# Altium project 自研超级电容控制器_DEMO5.PrjPcb
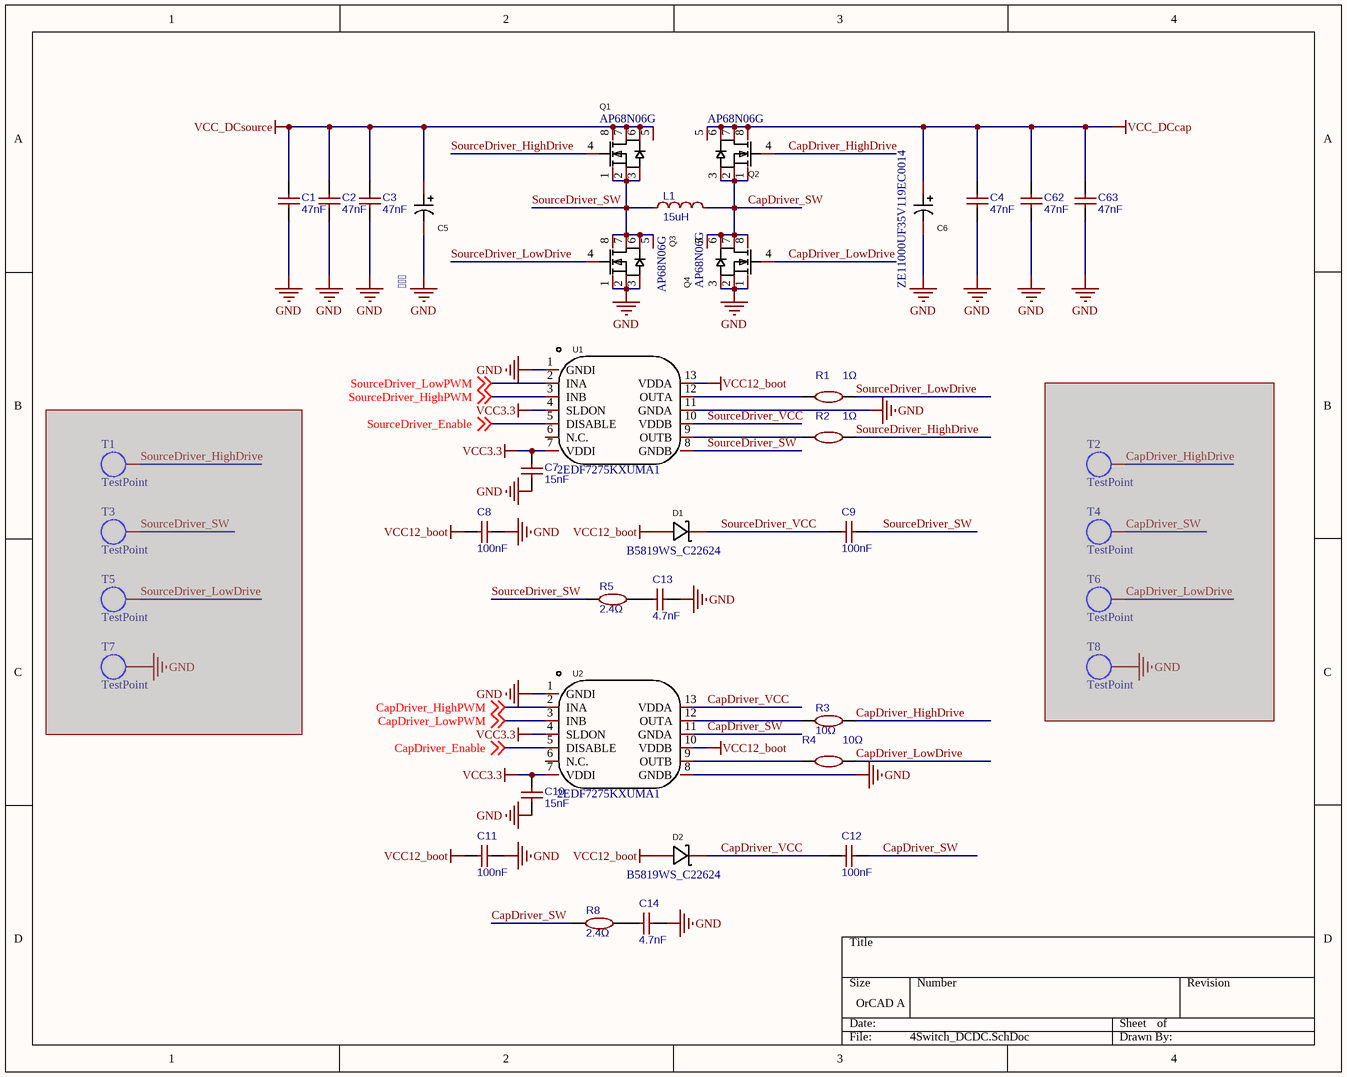
[diagram p0: 4Switch_DCDC.SchDoc]
4 sheets, 201 parts. Net scope: global (net labels, ports and power ports of the same name join across sheets).
Board file: PCB2.PcbDoc
Sheets:
  4Switch_DCDC.SchDoc
  PowerManagement.SchDoc
  Signal.SchDoc
  Controller.SchDoc

## Sheet 4Switch_DCDC.SchDoc
size OrCAD A; SheetNumber: 1; SheetTotal: 4

### Parts
C1  47nF  [C-RAD-0805]
C2  47nF  [C-RAD-0805]
C3  47nF  [C-RAD-0805]
C4  47nF  [C-RAD-0805]
C5    [CAP-TH_BD10.0-P5.00-D0.6-FD-A]
C6  ZE11000UF35V119EC0014  [CAP-TH_BD10.0-P5.00-D0.6-FD-A]
C7  15nF  [C-RAD-0603]
C8  100nF  [C-RAD-0603]
C9  100nF  [C-RAD-0603]
C10  15nF  [C-RAD-0603]
C11  100nF  [C-RAD-0603]
C12  100nF  [C-RAD-0603]
C13  4.7nF  [C-RAD-0805]
C14  4.7nF  [C-RAD-0805]
C62  47nF  [C-RAD-0805]
C63  47nF  [C-RAD-0805]
D1  B5819WS_C22624  [SOD-323_L1.8-W1.3-LS2.5-BI]
D2  B5819WS_C22624  [SOD-323_L1.8-W1.3-LS2.5-BI]
L1  15uH  [L-SMD-22]
Q1  AP68N06G  [VDFN8]
Q2  AP68N06G  [VDFN8]
Q3  AP68N06G  [VDFN8]
Q4  AP68N06G  [VDFN8]
R1  1Ω  [0603-1]
R2  1Ω  [0603-1]
R3  10Ω  [0603-1]
R4  10Ω  [0603-1]
R5  2.4Ω  [0805-1]
R8  2.4Ω  [0805-1]
T1  TestPoint  [TestPoint]  (masked out: inside a compile mask, not in the netlist)
T2  TestPoint  [TestPoint]  (masked out: inside a compile mask, not in the netlist)
T3  TestPoint  [TestPoint]  (masked out: inside a compile mask, not in the netlist)
T4  TestPoint  [TestPoint]  (masked out: inside a compile mask, not in the netlist)
T5  TestPoint  [TestPoint]  (masked out: inside a compile mask, not in the netlist)
T6  TestPoint  [TestPoint]  (masked out: inside a compile mask, not in the netlist)
T7  TestPoint  [TestPoint]  (masked out: inside a compile mask, not in the netlist)
T8  TestPoint  [TestPoint]  (masked out: inside a compile mask, not in the netlist)
U1  2EDF7275KXUMA1  [LGA-13]
U2  2EDF7275KXUMA1  [LGA-13]

### Nets
GND: C1.1 C2.1 C3.1 C4.1 C5.2 C6.2 C7.1 C8.2 C10.1 C11.2 C13.2 C14.2 C62.1 C63.1 Q3.1(S) Q3.2(S) Q3.3(S) Q4.1(S) Q4.2(S) Q4.3(S) U1.1(GNDI) U1.11(GNDA) U2.1(GNDI) U2.8(GNDB)
VCC3.3: C7.2 C10.2 U1.4(SLDON) U1.7(VDDI) U2.4(SLDON) U2.7(VDDI)
VCC12_boot: C8.1 C11.1 D1.2(A) D2.2(A) U1.13(VDDA) U2.10(VDDB)
VCC_DCcap: C4.2 C6.1 C62.2 C63.2 Q2.5(D) Q2.6(D) Q2.7(D) Q2.8(D)
VCC_DCsource: C1.2 C2.2 C3.2 C5.1 Q1.5(D) Q1.6(D) Q1.7(D) Q1.8(D)
CapDriver_Enable: U2.5(DISABLE) ; off-sheet CapDriver_Enable
CapDriver_HighDrive: Q2.4(G) R3.2
CapDriver_HighPWM: U2.2(INA) ; off-sheet CapDriver_HighPWM
CapDriver_LowDrive: Q4.4(G) R4.2
CapDriver_LowPWM: U2.3(INB) ; off-sheet CapDriver_LowPWM
CapDriver_SW: C12.2 L1.2 Q2.1(S) Q2.2(S) Q2.3(S) Q4.5(D) Q4.6(D) Q4.7(D) Q4.8(D) R8.1 U2.11(GNDA)
CapDriver_VCC: C12.1 D2.1(K) U2.13(VDDA)
SourceDriver_Enable: U1.5(DISABLE) ; off-sheet SourceDriver_Enable
SourceDriver_HighDrive: Q1.4(G) R2.2
SourceDriver_HighPWM: U1.3(INB) ; off-sheet SourceDriver_HighPWM
SourceDriver_LowDrive: Q3.4(G) R1.2
SourceDriver_LowPWM: U1.2(INA) ; off-sheet SourceDriver_LowPWM
SourceDriver_SW: C9.2 L1.1 Q1.1(S) Q1.2(S) Q1.3(S) Q3.5(D) Q3.6(D) Q3.7(D) Q3.8(D) R5.1 U1.8(GNDB)
SourceDriver_VCC: C9.1 D1.1(K) U1.10(VDDB)
NetC13_1: C13.1 R5.2
NetC14_1: C14.1 R8.2
NetR1_1: R1.1 U1.12(OUTA)
NetR2_1: R2.1 U1.9(OUTB)
NetR3_1: R3.1 U2.12(OUTA)
NetR4_1: R4.1 U2.9(OUTB)

Not connected (* = marked no-connect by the designer): U1 6(N.C.); U2 6(N.C.)

### Library data of the parts
C1-C4 C62 C63 = 47nF: CL21B473KBCNNNC; BOM_Manufacturer: Guangdong Fenghua Advanced Tech; nameAlias: Capacitance; Contributor: LCSC; BOM_Supplier: LCSC; BOM_Supplier Part: C157687; BOM_Manufacturer Part: CL21B473KBCNNNC; BOM_JLCPCB Part Class: Extended Part; spicePre: C; spiceSymbolName: 0805CG330J500NT
C5 C6 = ZE11000UF35V119EC0014: Manufacturer: KNSCHA(科尼盛); Name: 1000uF; Add into BOM: yes; Value: 1000uF; Tolerance: ±20%; Rated Voltage: 35V; φD: 10mm; L: 17mm; Ripple Current: 6.2A@100kHz; Equivalent Series Resistance(ESR): 8mΩ@100kHz; Lifetime @ Temp: 2000hrs@105℃; Symbol: ZE11000UF35V119EC0014; Device: ZE11000UF35V119EC0014; LCSC Part Name: 1000uF ±20% 35V; Supplier Part: C2992586; Manufacturer Part: ZE11000UF35V119EC0014; Supplier Footprint: 径向引线,10x17mm; JLCPCB Part Class: Extended Part; Datasheet: https://atta.szlcsc.com/upload/public/pdf/source/20220418/57B24F92C08E224D784EAACECC03E503.pdf; Supplier: LCSC; Convert to PCB: yes; Lead Spacing: 5mm; Operating Temperature: -40℃~+105℃
C7 C10 = 15nF: BOM_Manufacturer: Guangdong Fenghua Advanced Tech; BOM_Manufacturer Part: 0805CG330J500NT; nameAlias: Capacitance; Contributor: LCSC; BOM_Supplier: LCSC; BOM_Supplier Part: C157687; BOM_JLCPCB Part Class: Extended Part; spicePre: C; spiceSymbolName: 0805CG330J500NT
C8 C9 C11 C12 = 100nF: BOM_Manufacturer: Guangdong Fenghua Advanced Tech; BOM_Manufacturer Part: 0805CG330J500NT; nameAlias: Capacitance; Contributor: LCSC; BOM_Supplier: LCSC; BOM_Supplier Part: C157687; BOM_JLCPCB Part Class: Extended Part; spicePre: C; spiceSymbolName: 0805CG330J500NT
C13 C14 = 4.7nF: BOM_Manufacturer: Guangdong Fenghua Advanced Tech; BOM_Manufacturer Part: 0805CG330J500NT; nameAlias: Capacitance; Contributor: LCSC; BOM_Supplier: LCSC; BOM_Supplier Part: C157687; BOM_JLCPCB Part Class: Extended Part; spicePre: C; spiceSymbolName: 0805CG330J500NT
D1 D2 = B5819WS_C22624: Manufacturer: CJ(江苏长电/长晶); Add into BOM: yes; Reverse Voltage (Vr): 40V; Average Rectified Current (Io): 1A; Forward Voltage (Vf@If): 600mV@1A; Name: B5819WS; Symbol: B5819WS_C22624; Device: B5819WS_C22624; LCSC Part Name: 40V 1A 600mV@1A; Supplier Part: C22624; Manufacturer Part: B5819WS; Supplier Footprint: SOD-323; JLCPCB Part Class: Extended Part; Datasheet: https://atta.szlcsc.com/upload/public/pdf/source/20170919/C22624_1505799673448977596.pdf; Supplier: LCSC; Convert to PCB: yes
L1 = 15uH_CY: BOM_Manufacturer: 3L COILS; BOM_Manufacturer Part: SNR8040K-470M; nameAlias: Inductance; Contributor: LCSC; BOM_Supplier: LCSC; BOM_Supplier Part: C326356; spicePre: L; spiceSymbolName: SNR8040K-470M
Q1-Q4 = AP68N06G: Manufacturer: AOS; Name: AO3400A; Device: AO3400A_C20917; Add into BOM: yes; Type: N沟道; Drain Source Voltage (Vdss): 30V; Continuous Drain Current (Id): 5.7A; Power Dissipation (Pd): 1.4W; Drain Source On Resistance (RDS(on)@Vgs,Id): 26.5mΩ@10V,5.7A; Gate Threshold Voltage (Vgs(th)@Id): 1.5V@250μA; Symbol: AO3400A; LCSC Part Name: N沟道 30V 5.7A; Supplier Part: C20917; Manufacturer Part: AO3400A; Supplier Footprint: SOT-23-3L; JLCPCB Part Class: Basic Part; Datasheet: https://atta.szlcsc.com/upload/public/pdf/source/20140107/1457706668533.pdf; Supplier: LCSC; Convert to PCB: yes
R1-R4 = 10Ω: BOM_Manufacturer: UniOhm; BOM_Manufacturer Part: 0603WAF1002T5E; nameAlias: Resistance; Resistance (Ohms): 10K; BOM_Supplier: LCSC; BOM_Supplier Part: C25804; BOM_JLCPCB Part Class: Basic Part; spicePre: R; spiceSymbolName: 0603WAF1002T5E
R5 R8 = 2.4Ω: BOM_Manufacturer: UniOhm; BOM_Manufacturer Part: 0603WAF1002T5E; nameAlias: Resistance; Resistance (Ohms): 10K; BOM_Supplier: LCSC; BOM_Supplier Part: C25804; BOM_JLCPCB Part Class: Basic Part; spicePre: R; spiceSymbolName: 0603WAF1002T5E
U1 U2 = 2EDF7275KXUMA1: Manufacturer: Infineon(英飞凌); Add into BOM: yes; Driven Configuration: 半桥; Number of Drivers: 2; loadtype: MOSFET; Supply Voltage: 3V~3.5V; Peak Output Current(sink): 4A; Peak Output Current(source): 8A; Rise Time: 6.5ns; Fall Time: 4.5ns; Name: 2EDF7275KXUMA1; Symbol: 2EDF7275KXUMA1; Device: 2EDF7275KXUMA1; LCSC Part Name: 半桥 MOSFET 灌:4A 拉:8A; Supplier Part: C2677063; Manufacturer Part: 2EDF7275KXUMA1; Supplier Footprint: TFLGA-13-1; JLCPCB Part Class: Extended Part; Datasheet: https://atta.szlcsc.com/upload/public/pdf/source/20210606/C69F41D9A598FEEE25D6E8D6BBA83E77.pdf; Supplier: LCSC; Convert to PCB: yes; Operating Temperature: -40℃~+150℃@(Tj)

## Sheet PowerManagement.SchDoc
size OrCAD A; SheetNumber: 2; SheetTotal: 4
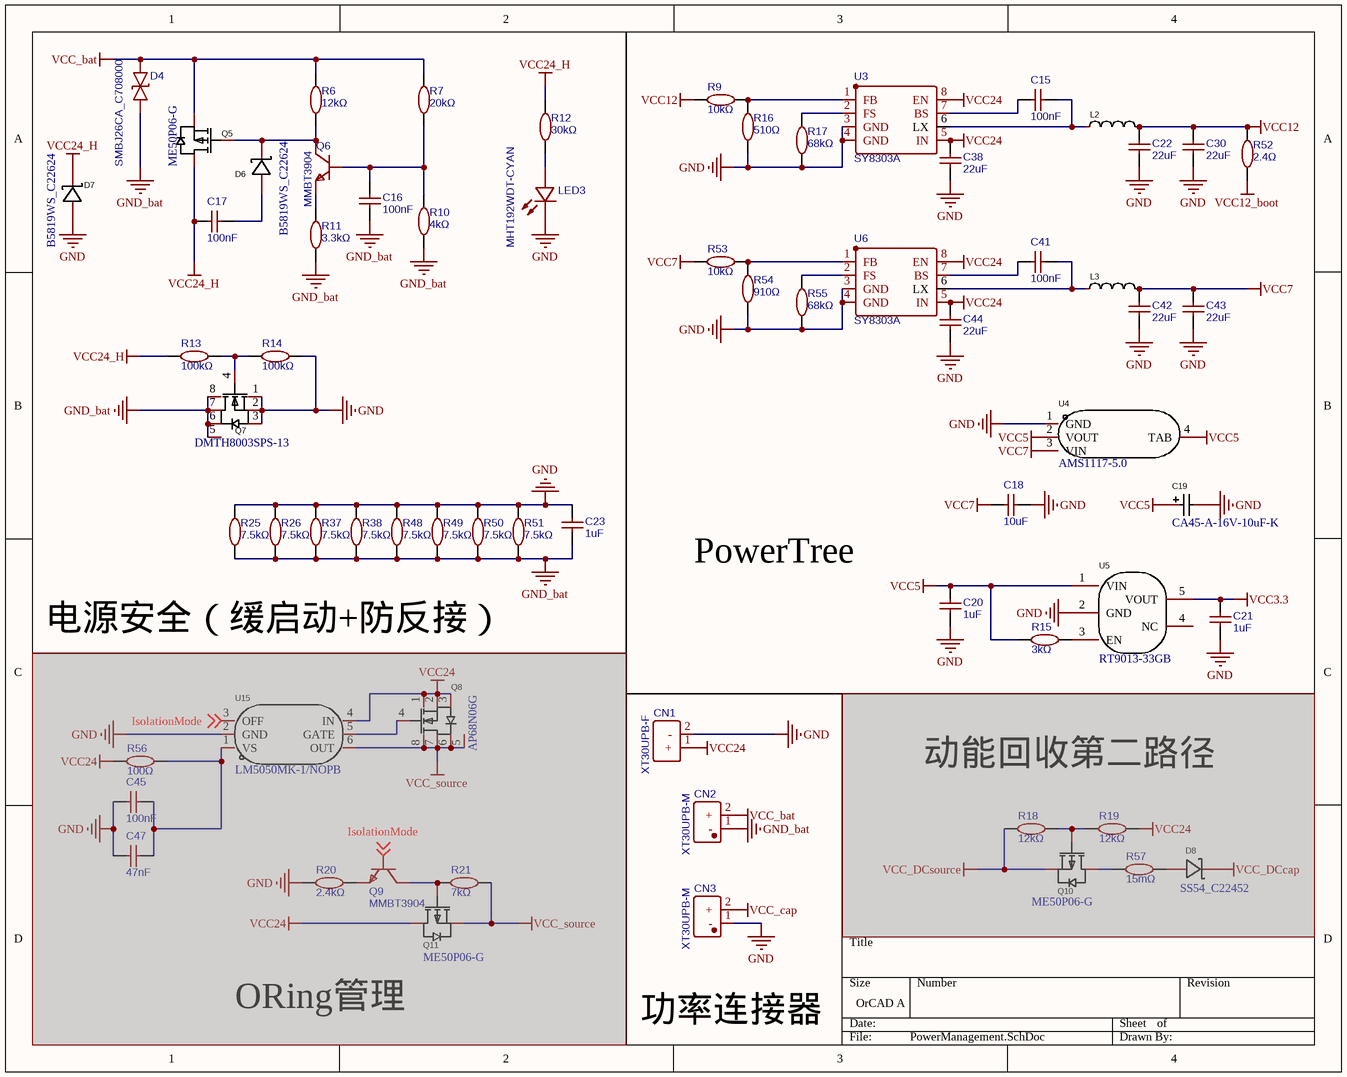
[diagram p1: PowerManagement.SchDoc]

### Parts
(Parts that share a designator on the sheet are numbered #1, #2 ... from top to bottom, then left to right.)
C15  100nF  [C-RAD-0603]
C16  100nF  [C-RAD-0603]
C17  100nF  [C-RAD-0603]
C18  10uF  [C-RAD-0805]
C19  CA45-A-16V-10uF-K  [CAP-3216]
C20  1uF  [C-RAD-0603]
C21  1uF  [C-RAD-0603]
C22  22uF  [C-RAD-0805]
C23  1uF  [C-RAD-0603]
C30  22uF  [C-RAD-0805]
C38  22uF  [C-RAD-0805]
C41  100nF  [C-RAD-0603]
C42  22uF  [C-RAD-0805]
C43  22uF  [C-RAD-0805]
C44  22uF  [C-RAD-0805]
C45#1  100nF  [C-RAD-0603]  (masked out: inside a compile mask, not in the netlist)
C47#1  47nF  [C-RAD-0805]  (masked out: inside a compile mask, not in the netlist)
CN1  XT30UPB-F  [CONN-TH_XT30UPB-F]
CN2  XT30UPB-M  [CONN-TH_XT30UPB-M]
CN3  XT30UPB-M  [CONN-TH_XT30UPB-M]
D4  SMBJ26CA_C708000  [SMB_L4.6-W3.6-LS5.3-BI]
D6  B5819WS_C22624  [SOD-323_L1.8-W1.3-LS2.5-BI]
D7  B5819WS_C22624  [SOD-323_L1.8-W1.3-LS2.5-BI]
D8  SS54_C22452  [SMA_L4.4-W2.8-LS5.4-R-RD]  (masked out: inside a compile mask, not in the netlist)
L2  MWSA0402S-100MT  [L-SMD-4.5]  (value not drawn)
L3  MWSA0402S-100MT  [L-SMD-4.5]  (value not drawn)
LED3  MHT192WDT-CYAN  [LED_0805]
Q5  ME50P06-G  [TO-252-2]
Q6  MMBT3904  [SOT-23]
Q7  DMTH8003SPS-13  [PowerDI5060-8]
Q8  AP68N06G  [VDFN8]  (masked out: inside a compile mask, not in the netlist)
Q9  MMBT3904  [SOT-23]  (masked out: inside a compile mask, not in the netlist)
Q10  ME50P06-G  [TO-252-2]  (masked out: inside a compile mask, not in the netlist)
Q11  ME50P06-G  [TO-252-2]  (masked out: inside a compile mask, not in the netlist)
R6  12kΩ  [0603-1]
R7  20kΩ  [0603-1]
R9  10kΩ  [0603-1]
R10  4kΩ  [0603-1]
R11  3.3kΩ  [0603-1]
R12  30kΩ  [0603-1]
R13  100kΩ  [0603-1]
R14  100kΩ  [0603-1]
R15  3kΩ  [0603-1]
R16  510Ω  [0603-1]
R17  68kΩ  [0603-1]
R18  12kΩ  [0603-1]  (masked out: inside a compile mask, not in the netlist)
R19  12kΩ  [0603-1]  (masked out: inside a compile mask, not in the netlist)
R20  2.4kΩ  [0603-1]  (masked out: inside a compile mask, not in the netlist)
R21  7kΩ  [0603-1]  (masked out: inside a compile mask, not in the netlist)
R25  7.5kΩ  [0805-1]
R26  7.5kΩ  [0805-1]
R37  7.5kΩ  [0805-1]
R38  7.5kΩ  [0805-1]
R48  7.5kΩ  [0805-1]
R49  7.5kΩ  [0805-1]
R50  7.5kΩ  [0805-1]
R51  7.5kΩ  [0805-1]
R52  2.4Ω  [0603-1]
R53  10kΩ  [0603-1]
R54  910Ω  [0603-1]
R55  68kΩ  [0603-1]
R56  100Ω  [0603-1]  (masked out: inside a compile mask, not in the netlist)
R57  15mΩ  [2512]  (masked out: inside a compile mask, not in the netlist)
U3  SY8303A  [TSOT23-8]
U4  AMS1117-5.0  [SOT-223]
U5  RT9013-33GB  [SOT-23-5_L3.0-W1.7-P0.95-LS2.8-BL]
U6  SY8303A  [TSOT23-8]
U15  LM5050MK-1/NOPB  [TSOT23-6]  (masked out: inside a compile mask, not in the netlist)

### Nets
GND: C18.2 C19.2 C20.2 C21.2 C22.1 C23.2 C30.1 C38.1 C42.1 C43.1 C44.1 CN1.2(-) CN3.1(-) D7.2(A) LED3.2(K) Q7.1(S) Q7.2(S) Q7.3(S) R14.1 R16.1 R17.1 R25.2 R26.2 R37.2 R38.2 R48.2 R49.2 R50.2 R51.2 R54.1 R55.1 U3.3(GND) U3.4(GND) U4.1(GND) U5.2(GND) U6.3(GND) U6.4(GND)
GND_bat: C16.1 C23.1 CN2.1(-) D4.1 Q7.5(D) Q7.6(D) Q7.7(D) Q7.8(D) R10.1 R11.1 R25.1 R26.1 R37.1 R38.1 R48.1 R49.1 R50.1 R51.1
VCC3.3: C21.1 U5.5(VOUT)
VCC5: C19.1 C20.1 R15.1 U4.2(VOUT) U4.4(TAB) U5.1(VIN)
VCC7: C18.1 C42.2 C43.2 L3.2 R53.1 U4.3(VIN)
VCC12: C22.2 C30.2 L2.2 R9.1 R52.1
VCC12_boot: R52.2
VCC24: C38.2 C44.2 CN1.1(+) U3.5(IN) U3.8(EN) U6.5(IN) U6.8(EN)
VCC24_H: C17.2 D7.1(K) Q5.2(D) R12.2 R13.2
VCC_bat: CN2.2(+) D4.2 Q5.3(S) R6.2 R7.2
VCC_cap: CN3.2(+)
NetC15_1: C15.1 L2.1 U3.6(LX)
NetC15_2: C15.2 U3.7(BS)
NetC16_2: C16.2 Q6.1(B) R7.1 R10.2
NetC17_1: C17.1 D6.2(A)
NetC41_1: C41.1 L3.1 U6.6(LX)
NetC41_2: C41.2 U6.7(BS)
NetD6_1: D6.1(K) Q5.1(G) Q6.3(C) R6.1
NetLED3_1: LED3.1(A) R12.1
NetQ6_2: Q6.2(E) R11.2
NetQ7_4: Q7.4(G) R13.1 R14.2
NetR9_2: R9.2 R16.2 U3.1(FB)
NetR15_2: R15.2 U5.3(EN)
NetR17_2: R17.2 U3.2(FS)
NetR53_2: R53.2 R54.2 U6.1(FB)
NetR55_2: R55.2 U6.2(FS)

Not connected (* = marked no-connect by the designer): U5 4(NC)

### Notes on the sheet
- PowerTree
- 电源安全（缓启动+防反接）
- 动能回收第二路径
- ORing管理
- 功率连接器

### Library data of the parts
C15-C17 C41 C45#1 = 100nF: as C8 on sheet 4Switch_DCDC; BOM_Supplier: LCSC; BOM_Supplier Part: C157687; BOM_JLCPCB Part Class: Extended Part; spicePre: C; spiceSymbolName: 0805CG330J500NT
C18 = 10uF: BOM_Manufacturer: Guangdong Fenghua Advanced Tech; BOM_Manufacturer Part: 0805CG330J500NT; nameAlias: Capacitance; Contributor: LCSC; BOM_Supplier: LCSC; BOM_Supplier Part: C157687; BOM_JLCPCB Part Class: Extended Part; spicePre: C; spiceSymbolName: 0805CG330J500NT
C19 = CA45-A-16V-10uF-K: Manufacturer: CEC(振华新云); Name: 10uF; Add into BOM: yes; Value: 10uF; Tolerance: ±10%; Rated Voltage: 16V; Equivalent Series Resistance(ESR): 10Ω@100kHz; Symbol: CA45-A-16V-10UF-K; Device: CA45-A-16V-10uF-K; LCSC Part Name: 10uF ±10% 16V; Supplier Part: C128254; Manufacturer Part: CA45-A-16V-10uF-K; Supplier Footprint: CASE-A-3216; JLCPCB Part Class: Extended Part; Datasheet: https://atta.szlcsc.com/upload/public/pdf/source/20170914/C128254_1505359752472967905.pdf; Supplier: LCSC; Convert to PCB: yes; Operating Temperature: -55℃~+125℃
C20 C21 C23 = 1uF: BOM_Manufacturer: Guangdong Fenghua Advanced Tech; BOM_Manufacturer Part: 0805CG330J500NT; nameAlias: Capacitance; Contributor: LCSC; BOM_Supplier: LCSC; BOM_Supplier Part: C157687; BOM_JLCPCB Part Class: Extended Part; spicePre: C; spiceSymbolName: 0805CG330J500NT
C22 C30 C38 C42-C44 = 22uF: BOM_Manufacturer: Guangdong Fenghua Advanced Tech; BOM_Manufacturer Part: 0805CG330J500NT; nameAlias: Capacitance; Contributor: LCSC; BOM_Supplier: LCSC; BOM_Supplier Part: C157687; BOM_JLCPCB Part Class: Extended Part; spicePre: C; spiceSymbolName: 0805CG330J500NT
C47#1 = 47nF: as C1 on sheet 4Switch_DCDC; BOM_Supplier: LCSC; BOM_Supplier Part: C157687; BOM_Manufacturer Part: CL21B473KBCNNNC; BOM_JLCPCB Part Class: Extended Part; spicePre: C; spiceSymbolName: 0805CG330J500NT
CN1 = XT30UPB-F: BOM_Manufacturer: Changzhou Amass Elec; nameAlias: Value; Contributor: LCSC; BOM_Supplier: LCSC; BOM_Supplier Part: C108769; BOM_Manufacturer Part: XT30UPB-F; BOM_JLCPCB Part Class: Extended Part; spicePre: C; spiceSymbolName: XT30UPB-F
CN2 CN3 = XT30UPB-M: BOM_Manufacturer: Changzhou Amass Elec; Contributor: LCSC; BOM_Supplier: LCSC; BOM_Supplier Part: C428721; BOM_Manufacturer Part: XT30UPB-M; BOM_JLCPCB Part Class: Extended Part; spicePre: C; spiceSymbolName: XT30UPB-M
D4 = SMBJ26CA_C708000: BOM_Manufacturer: FTR; Contributor: LCSC; BOM_Supplier: LCSC; BOM_Supplier Part: C708000; BOM_Manufacturer Part: SMBJ26CA; BOM_JLCPCB Part Class: Extended Part; spicePre: D; spiceSymbolName: SMBJ26CA_C708000
D6 D7 = B5819WS_C22624: as D1 on sheet 4Switch_DCDC; Name: B5819WS; Symbol: B5819WS_C22624; Device: B5819WS_C22624; LCSC Part Name: 40V 1A 600mV@1A; Supplier Part: C22624; Manufacturer Part: B5819WS; Supplier Footprint: SOD-323; JLCPCB Part Class: Extended Part; Datasheet: https://atta.szlcsc.com/upload/public/pdf/source/20170919/C22624_1505799673448977596.pdf; Supplier: LCSC; Convert to PCB: yes
D8 = SS54_C22452: Manufacturer: MDD; Name: SS54; Add into BOM: yes; Reverse Voltage (Vr): 40V; Average Rectified Current (Io): 5A; Forward Voltage (Vf@If): 550mV@5A; Symbol: SS54_C22452; Device: SS54_C22452; LCSC Part Name: 40V 5A 550mV@5A; Supplier Part: C22452; Manufacturer Part: SS54; Supplier Footprint: SMA(DO-214AC); JLCPCB Part Class: Basic Part; Datasheet: https://atta.szlcsc.com/upload/public/pdf/source/20190306/C22452_DC5E4F74C3B638F6D8E4C7650D5BF30E.pdf; Supplier: LCSC; Convert to PCB: yes
L2 L3 = MWSA0402S-100MT: Manufacturer: Sunlord(顺络); Name: 10uH; Add into BOM: yes; Value: 10uH; Tolerance: ±20%; Rated Current: 1.6A; Saturation Current (Isat): 2A; DC Resistance (DCR): 282mΩ; Symbol: MWSA0402S-100MT; Device: MWSA0402S-100MT; LCSC Part Name: 10uH ±20% 2A; Supplier Part: C408339; Manufacturer Part: MWSA0402S-100MT; Supplier Footprint: SMD; JLCPCB Part Class: Extended Part; Datasheet: https://atta.szlcsc.com/upload/public/pdf/source/20190729/C408339_3BC98729F1BEEFAE5AEBBEB66576AB79.pdf; Supplier: LCSC; Convert to PCB: yes; Type: -; Ratings: -
LED3 = MHT192WDT-CYAN: BOM_Manufacturer: MEIHUA; Contributor: LCSC; BOM_Supplier: LCSC; BOM_Supplier Part: C496821; BOM_Manufacturer Part: MHT192WDT-CYAN; BOM_JLCPCB Part Class: Extended Part; spicePre: L; spiceSymbolName: MHT192WDT-CYAN
Q5 Q10 Q11 = ME50P06-G: Manufacturer: MATSUKI(松木); Add into BOM: yes; Type: P沟道; Drain Source Voltage (Vdss): 60V; Continuous Drain Current (Id): 61A; Power Dissipation (Pd): 114W; Drain Source On Resistance (RDS(on)@Vgs,Id): 17mΩ@10V,17A; Gate Threshold Voltage (Vgs(th)@Id): 3V@250μA; Name: ME50P06-G; Symbol: ME50P06; Device: ME50P06-G; LCSC Part Name: P沟道 60V 61A; Supplier Part: C165230; Manufacturer Part: ME50P06-G; Supplier Footprint: TO-252-2(DPAK); JLCPCB Part Class: Extended Part; Datasheet: https://atta.szlcsc.com/upload/public/pdf/source/20180316/EC2C67353FCE0BEDF2188A18E5230379.pdf; Supplier: LCSC; Convert to PCB: yes
Q6 Q9 = MMBT3904: BOM_Manufacturer: High Diode; BOM_Manufacturer Part: S8050; Contributor: LCSC; BOM_Supplier: LCSC; BOM_Supplier Part: C466625; BOM_JLCPCB Part Class: Extended Part; spicePre: Q; spiceSymbolName: S8050_C466625
Q7 = DMTH8003SPS-13: Manufacturer: AOS; Name: AO3400A; Device: AO3400A_C20917; Add into BOM: yes; Type: N沟道; Drain Source Voltage (Vdss): 30V; Continuous Drain Current (Id): 5.7A; Power Dissipation (Pd): 1.4W; Drain Source On Resistance (RDS(on)@Vgs,Id): 26.5mΩ@10V,5.7A; Gate Threshold Voltage (Vgs(th)@Id): 1.5V@250μA; Symbol: AO3400A; LCSC Part Name: N沟道 30V 5.7A; Supplier Part: C20917; Manufacturer Part: AO3400A; Supplier Footprint: SOT-23-3L; JLCPCB Part Class: Basic Part; Datasheet: https://atta.szlcsc.com/upload/public/pdf/source/20140107/1457706668533.pdf; Supplier: LCSC; Convert to PCB: yes
Q8 = AP68N06G: as Q1 on sheet 4Switch_DCDC; Symbol: AO3400A; LCSC Part Name: N沟道 30V 5.7A; Supplier Part: C20917; Manufacturer Part: AO3400A; Supplier Footprint: SOT-23-3L; JLCPCB Part Class: Basic Part; Datasheet: https://atta.szlcsc.com/upload/public/pdf/source/20140107/1457706668533.pdf; Supplier: LCSC; Convert to PCB: yes
R6 R18 R19 = 12kΩ: BOM_Manufacturer: UniOhm; BOM_Manufacturer Part: 0603WAF1002T5E; nameAlias: Resistance; Resistance (Ohms): 10K; BOM_Supplier: LCSC; BOM_Supplier Part: C25804; BOM_JLCPCB Part Class: Basic Part; spicePre: R; spiceSymbolName: 0603WAF1002T5E
R7 = 20kΩ: BOM_Manufacturer: UniOhm; BOM_Manufacturer Part: 0603WAF1002T5E; nameAlias: Resistance; Resistance (Ohms): 10K; BOM_Supplier: LCSC; BOM_Supplier Part: C25804; BOM_JLCPCB Part Class: Basic Part; spicePre: R; spiceSymbolName: 0603WAF1002T5E
R9 R53 = 10kΩ: BOM_Manufacturer: UniOhm; BOM_Manufacturer Part: 0603WAF1002T5E; nameAlias: Resistance; Resistance (Ohms): 10K; BOM_Supplier: LCSC; BOM_Supplier Part: C25804; BOM_JLCPCB Part Class: Basic Part; spicePre: R; spiceSymbolName: 0603WAF1002T5E
R10 = 4kΩ: BOM_Manufacturer: UniOhm; BOM_Manufacturer Part: 0603WAF1002T5E; nameAlias: Resistance; Resistance (Ohms): 10K; BOM_Supplier: LCSC; BOM_Supplier Part: C25804; BOM_JLCPCB Part Class: Basic Part; spicePre: R; spiceSymbolName: 0603WAF1002T5E
R11 = 3.3kΩ: BOM_Manufacturer: UniOhm; BOM_Manufacturer Part: 0603WAF1002T5E; nameAlias: Resistance; Resistance (Ohms): 10K; BOM_Supplier: LCSC; BOM_Supplier Part: C25804; BOM_JLCPCB Part Class: Basic Part; spicePre: R; spiceSymbolName: 0603WAF1002T5E
R12 = 30kΩ: BOM_Manufacturer: UniOhm; BOM_Manufacturer Part: 0603WAF1002T5E; nameAlias: Resistance; Resistance (Ohms): 10K; BOM_Supplier: LCSC; BOM_Supplier Part: C25804; BOM_JLCPCB Part Class: Basic Part; spicePre: R; spiceSymbolName: 0603WAF1002T5E
R13 R14 = 100kΩ: BOM_Manufacturer: UniOhm; BOM_Manufacturer Part: 0603WAF1002T5E; nameAlias: Resistance; Resistance (Ohms): 10K; BOM_Supplier: LCSC; BOM_Supplier Part: C25804; BOM_JLCPCB Part Class: Basic Part; spicePre: R; spiceSymbolName: 0603WAF1002T5E
R15 = 3kΩ: BOM_Manufacturer: UniOhm; BOM_Manufacturer Part: 0603WAF1002T5E; nameAlias: Resistance; Resistance (Ohms): 10K; BOM_Supplier: LCSC; BOM_Supplier Part: C25804; BOM_JLCPCB Part Class: Basic Part; spicePre: R; spiceSymbolName: 0603WAF1002T5E
R16 = 510Ω: BOM_Manufacturer: UniOhm; BOM_Manufacturer Part: 0603WAF1002T5E; nameAlias: Resistance; Resistance (Ohms): 10K; BOM_Supplier: LCSC; BOM_Supplier Part: C25804; BOM_JLCPCB Part Class: Basic Part; spicePre: R; spiceSymbolName: 0603WAF1002T5E
R17 R55 = 68kΩ: BOM_Manufacturer: UniOhm; BOM_Manufacturer Part: 0603WAF1002T5E; nameAlias: Resistance; Resistance (Ohms): 10K; BOM_Supplier: LCSC; BOM_Supplier Part: C25804; BOM_JLCPCB Part Class: Basic Part; spicePre: R; spiceSymbolName: 0603WAF1002T5E
R20 = 2.4kΩ: BOM_Manufacturer: UniOhm; BOM_Manufacturer Part: 0603WAF1002T5E; nameAlias: Resistance; Resistance (Ohms): 10K; BOM_Supplier: LCSC; BOM_Supplier Part: C25804; BOM_JLCPCB Part Class: Basic Part; spicePre: R; spiceSymbolName: 0603WAF1002T5E
R21 = 7kΩ: BOM_Manufacturer: UniOhm; BOM_Manufacturer Part: 0603WAF1002T5E; nameAlias: Resistance; Resistance (Ohms): 10K; BOM_Supplier: LCSC; BOM_Supplier Part: C25804; BOM_JLCPCB Part Class: Basic Part; spicePre: R; spiceSymbolName: 0603WAF1002T5E
R25 R26 R37 R38 R48-R51 = 7.5kΩ: BOM_Manufacturer: UniOhm; BOM_Manufacturer Part: 0603WAF1002T5E; nameAlias: Resistance; Resistance (Ohms): 10K; BOM_Supplier: LCSC; BOM_Supplier Part: C25804; BOM_JLCPCB Part Class: Basic Part; spicePre: R; spiceSymbolName: 0603WAF1002T5E
R52 = 2.4Ω: as R5 on sheet 4Switch_DCDC; BOM_Supplier: LCSC; BOM_Supplier Part: C25804; BOM_JLCPCB Part Class: Basic Part; spicePre: R; spiceSymbolName: 0603WAF1002T5E
R54 = 910Ω: BOM_Manufacturer: UniOhm; BOM_Manufacturer Part: 0603WAF1002T5E; nameAlias: Resistance; Resistance (Ohms): 10K; BOM_Supplier: LCSC; BOM_Supplier Part: C25804; BOM_JLCPCB Part Class: Basic Part; spicePre: R; spiceSymbolName: 0603WAF1002T5E
R56 = 100Ω: BOM_Manufacturer: UniOhm; BOM_Manufacturer Part: 0603WAF1002T5E; nameAlias: Resistance; Resistance (Ohms): 10K; BOM_Supplier: LCSC; BOM_Supplier Part: C25804; BOM_JLCPCB Part Class: Basic Part; spicePre: R; spiceSymbolName: 0603WAF1002T5E
R57 = 15mΩ: BOM_Manufacturer: UniOhm; BOM_Manufacturer Part: 0603WAF1002T5E; nameAlias: Resistance; Resistance (Ohms): 10K; BOM_Supplier: LCSC; BOM_Supplier Part: C25804; BOM_JLCPCB Part Class: Basic Part; spicePre: R; spiceSymbolName: 0603WAF1002T5E
U3 U6 = SY8303A: BOM_Manufacturer: Texas Instruments; BOM_Manufacturer Part: TPS5430DDAG4; Contributor: LCSC; BOM_Supplier: LCSC; BOM_Supplier Part: C201628; BOM_JLCPCB Part Class: Extended Part; spicePre: U; spiceSymbolName: TPS5430DDAG4
U4 = AMS1117-5.0: Manufacturer: UMW(广东友台半导体); Name: AMS1117-3.3; Symbol: AMS1117-3.3_C347222; Add into BOM: yes; Output Type: 固定; Output Polarity: 正; Number of Outputs: 1; Maximum Input Voltage: 18V; Output Voltage: 3.3V; Dropout Voltage: 1.3V@(1A); Output Current: 1A; Power Supply Rejection Ratio (PSRR): 60dB@(120Hz); Device: AMS1117-3.3_C347222; LCSC Part Name: 正 Vin=18V Vout=3.3V 1A 60dB@(120Hz); Supplier Part: C347222; Manufacturer Part: AMS1117-3.3; Supplier Footprint: SOT-223-4; JLCPCB Part Class: Extended Part; Datasheet: https://atta.szlcsc.com/upload/public/pdf/source/20211011/50CC665C22E3A66C08379A4A74BDA25C.pdf; Supplier: LCSC; Convert to PCB: yes
U5 = RT9013-33GB: Manufacturer: RICHTEK(台湾立锜); Add into BOM: yes; Output Type: 固定; Output Polarity: 正; Number of Outputs: 1; Maximum Input Voltage: 5.5V; Output Voltage: 3.3V; Dropout Voltage: 400mV@(500mA); Output Current: 500mA; Power Supply Rejection Ratio (PRSS): 50dB@(10kHz); Name: RT9013-33GB; Symbol: RT9013-33GB; Device: RT9013-33GB; LCSC Part Name: Vin=5.5V Vout=3.3V 500mA 50dB@(10kHz); Supplier Part: C47773; Manufacturer Part: RT9013-33GB; Supplier Footprint: SOT-23-5; JLCPCB Part Class: Extended Part; Datasheet: https://atta.szlcsc.com/upload/public/pdf/source/20150504/1457707282459.pdf; Supplier: LCSC; Convert to PCB: yes; Quiescent Current (Ground Current): -; Noise: -; Feature: -
U15 = LM5050MK-1/NOPB: Manufacturer: TI(德州仪器); Add into BOM: yes; Name: LM5050MK-1/NOPB; Symbol: LM5050MK-1/NOPB; Device: LM5050MK-1/NOPB; LCSC Part Name: LM5050MK-1/NOPB; Supplier Part: C129323; Manufacturer Part: LM5050MK-1/NOPB; Supplier Footprint: TSOT-23-6; JLCPCB Part Class: Extended Part; Datasheet: https://atta.szlcsc.com/upload/public/pdf/source/20170914/C129323_1505359957620968163.pdf; Supplier: LCSC; Convert to PCB: yes

## Sheet Signal.SchDoc
size OrCAD A; SheetNumber: 3; SheetTotal: 4
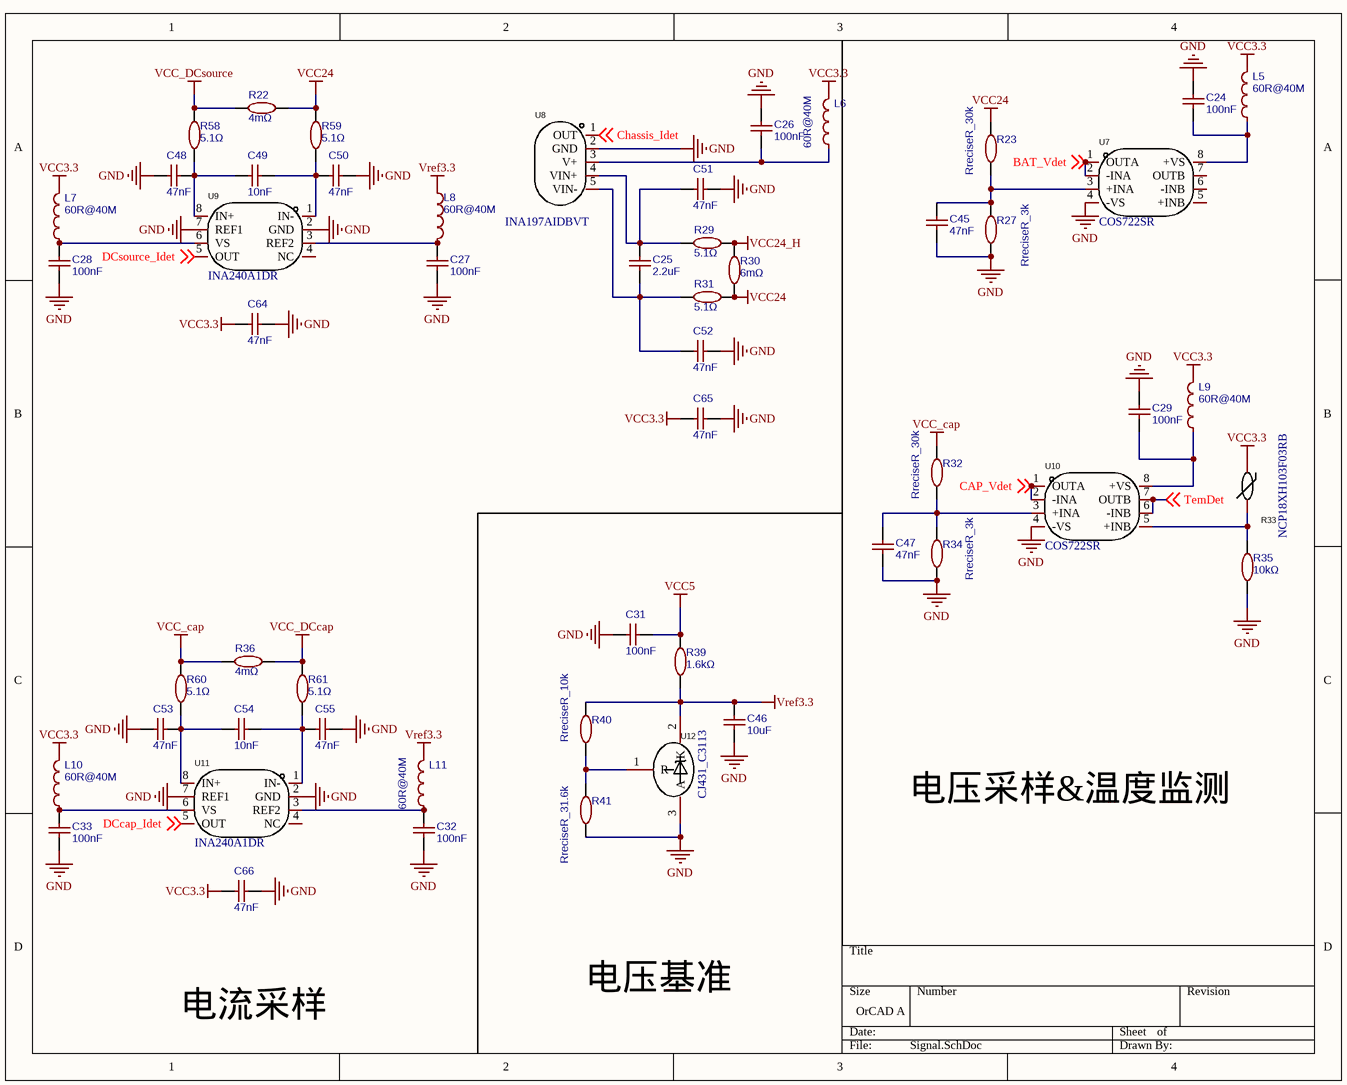
[diagram p2: Signal.SchDoc]

### Parts
(Parts that share a designator on the sheet are numbered #1, #2 ... from top to bottom, then left to right.)
C24  100nF  [C-RAD-0603]
C25  2.2uF  [C-RAD-0603]
C26  100nF  [C-RAD-0603]
C27  100nF  [C-RAD-0603]
C28  100nF  [C-RAD-0603]
C29  100nF  [C-RAD-0603]
C31  100nF  [C-RAD-0603]
C32  100nF  [C-RAD-0603]
C33  100nF  [C-RAD-0603]
C45#2  47nF  [C-RAD-0805]
C46  10uF  [C-RAD-0805]
C47#2  47nF  [C-RAD-0805]
C48  47nF  [C-RAD-0805]
C49  10nF  [C-RAD-0603]
C50  47nF  [C-RAD-0805]
C51  47nF  [C-RAD-0805]
C52  47nF  [C-RAD-0805]
C53  47nF  [C-RAD-0805]
C54  10nF  [C-RAD-0603]
C55  47nF  [C-RAD-0805]
C64  47nF  [C-RAD-0805]
C65  47nF  [C-RAD-0805]
C66  47nF  [C-RAD-0805]
L5  60R@40M  [0603-1]
L6  60R@40M  [0603-1]
L7  60R@40M  [0603-1]
L8  60R@40M  [0603-1]
L9  60R@40M  [0603-1]
L10  60R@40M  [0603-1]
L11  60R@40M  [0603-1]
R22  4mΩ  [2512]
R23  RreciseR_30k  [0603-1]
R27  RreciseR_3k  [0603-1]
R29  5.1Ω  [0603-1]
R30  6mΩ  [2512]
R31  5.1Ω  [0603-1]
R32  RreciseR_30k  [0603-1]
R33  NCP18XH103F03RB  [0603-1]
R34  RreciseR_3k  [0603-1]
R35  10kΩ  [0603-1]
R36  4mΩ  [2512]
R39  1.6kΩ  [0603-1]
R40  RreciseR_10k  [0603-1]
R41  RreciseR_31.6k  [0603-1]
R58  5.1Ω  [0603-1]
R59  5.1Ω  [0603-1]
R60  5.1Ω  [0603-1]
R61  5.1Ω  [0603-1]
U7  COS722SR  [SOIC127P610X175-8N]
U8  INA197AIDBVT  [SOT-23-5_L3.0-W1.7-P0.95-LS2.8-BL]
U9  INA240A1DR  [SOIC127P610X175-8N]
U10  COS722SR  [SOIC127P610X175-8N]
U11  INA240A1DR  [SOIC127P610X175-8N]
U12  CJ431_C3113  [SOT-23]

### Nets
GND: C24.2 C26.2 C27.2 C28.2 C29.2 C31.1 C32.2 C33.2 C45#2.1 C46.1 C47#2.1 C48.2 C50.1 C51.2 C52.2 C53.2 C55.2 C64.1 C65.1 C66.1 R27.1 R34.1 R35.2 R41.1 U7.4(-VS) U8.2(GND) U9.2(GND) U9.7(REF1) U10.4(-VS) U11.2(GND) U11.7(REF1) U12.3(A)
VCC3.3: C64.2 C65.2 C66.2 L5.2 L6.2 L7.2 L9.2 L10.2 R33.1
VCC5: C31.2 R39.2
VCC24: R22.2 R23.2 R30.1 R31.2 R59.2
VCC24_H: R29.2 R30.2
VCC_cap: R32.2 R36.1 R60.2
VCC_DCcap: R36.2 R61.2
VCC_DCsource: R22.1 R58.2
Vref3.3: C46.2 L8.1 L11.2 R39.1 R40.2 U12.2(K)
BAT_Vdet: U7.1(OUTA) U7.2(-INA) ; off-sheet BAT_Vdet
CAP_Vdet: U10.1(OUTA) U10.2(-INA) ; off-sheet CAP_Vdet
Chassis_Idet: U8.1(OUT) ; off-sheet Chassis_Idet
DCcap_Idet: U11.5(OUT) ; off-sheet DCcap_Idet
DCsource_Idet: U9.5(OUT) ; off-sheet DCsource_Idet
TemDet: U10.6(-INB) U10.7(OUTB) ; off-sheet TemDet
NetC24_1: C24.1 L5.1 U7.8(+VS)
NetC25_1: C25.1 C52.1 R31.1 U8.5(VIN-)
NetC25_2: C25.2 C51.1 R29.1 U8.4(VIN+)
NetC26_1: C26.1 L6.1 U8.3(V+)
NetC27_1: C27.1 L8.2 U9.3(REF2)
NetC28_1: C28.1 L7.1 U9.6(VS)
NetC29_1: C29.1 L9.1 U10.8(+VS)
NetC32_1: C32.1 L11.1 U11.3(REF2)
NetC33_1: C33.1 L10.1 U11.6(VS)
NetC45#2_2: C45#2.2 R23.1 R27.2 U7.3(+INA)
NetC47#2_2: C47#2.2 R32.1 R34.2 U10.3(+INA)
NetC48_1: C48.1 C49.1 R58.1 U9.8(IN+)
NetC49_2: C49.2 C50.2 R59.1 U9.1(IN-)
NetC53_1: C53.1 C54.1 R60.1 U11.8(IN+)
NetC54_2: C54.2 C55.1 R61.1 U11.1(IN-)
NetR33_2: R33.2 R35.1 U10.5(+INB)
NetR40_1: R40.1 R41.2 U12.1(R)

Not connected (* = marked no-connect by the designer): U7 5(+INB) 6(-INB) 7(OUTB); U9 4(NC); U11 4(NC)

### Notes on the sheet
- 电压采样&温度监测
- 电流采样
- 电压基准

### Library data of the parts
C24 C26-C29 C31-C33 = 100nF: as C8 on sheet 4Switch_DCDC; BOM_Supplier: LCSC; BOM_Supplier Part: C157687; BOM_JLCPCB Part Class: Extended Part; spicePre: C; spiceSymbolName: 0805CG330J500NT
C25 = 2.2uF: BOM_Manufacturer: Guangdong Fenghua Advanced Tech; BOM_Manufacturer Part: 0805CG330J500NT; nameAlias: Capacitance; Contributor: LCSC; BOM_Supplier: LCSC; BOM_Supplier Part: C157687; BOM_JLCPCB Part Class: Extended Part; spicePre: C; spiceSymbolName: 0805CG330J500NT
C45#2 C47#2 C48 C50-C53 C55 C64-C66 = 47nF: as C1 on sheet 4Switch_DCDC; BOM_Supplier: LCSC; BOM_Supplier Part: C157687; BOM_Manufacturer Part: CL21B473KBCNNNC; BOM_JLCPCB Part Class: Extended Part; spicePre: C; spiceSymbolName: 0805CG330J500NT
C46 = 10uF: as C18 on sheet PowerManagement; BOM_Supplier: LCSC; BOM_Supplier Part: C157687; BOM_JLCPCB Part Class: Extended Part; spicePre: C; spiceSymbolName: 0805CG330J500NT
C49 C54 = 10nF: BOM_Manufacturer: Guangdong Fenghua Advanced Tech; BOM_Manufacturer Part: 0805CG330J500NT; nameAlias: Capacitance; Contributor: LCSC; BOM_Supplier: LCSC; BOM_Supplier Part: C157687; BOM_JLCPCB Part Class: Extended Part; spicePre: C; spiceSymbolName: 0805CG330J500NT
L5-L11 = 60R@40M: BOM_Manufacturer: FH; BOM_Manufacturer Part: CBW201209U601T; nameAlias: Value; BOM_Supplier: LCSC; BOM_Supplier Part: C21286; BOM_JLCPCB Part Class: Extended Part; spicePre: L; spiceSymbolName: CBW201209U601T
R22 R36 = 3mΩ: BOM_Manufacturer: UniOhm; BOM_Manufacturer Part: 0603WAF1002T5E; nameAlias: Resistance; Resistance (Ohms): 10K; BOM_Supplier: LCSC; BOM_Supplier Part: C25804; BOM_JLCPCB Part Class: Basic Part; spicePre: R; spiceSymbolName: 0603WAF1002T5E
R23 R32 = RreciseR_30k: BOM_Manufacturer: UniOhm; BOM_Manufacturer Part: 0603WAF1002T5E; nameAlias: Resistance; Resistance (Ohms): 10K; BOM_Supplier: LCSC; BOM_Supplier Part: C25804; BOM_JLCPCB Part Class: Basic Part; spicePre: R; spiceSymbolName: 0603WAF1002T5E
R27 R34 = RreciseR_3k: BOM_Manufacturer: UniOhm; BOM_Manufacturer Part: 0603WAF1002T5E; nameAlias: Resistance; Resistance (Ohms): 10K; BOM_Supplier: LCSC; BOM_Supplier Part: C25804; BOM_JLCPCB Part Class: Basic Part; spicePre: R; spiceSymbolName: 0603WAF1002T5E
R29 R31 R58-R61 = 5.1Ω: BOM_Manufacturer: UniOhm; BOM_Manufacturer Part: 0603WAF1002T5E; nameAlias: Resistance; Resistance (Ohms): 10K; BOM_Supplier: LCSC; BOM_Supplier Part: C25804; BOM_JLCPCB Part Class: Basic Part; spicePre: R; spiceSymbolName: 0603WAF1002T5E
R30 = 6mΩ: BOM_Manufacturer: UniOhm; BOM_Manufacturer Part: 0603WAF1002T5E; nameAlias: Resistance; Resistance (Ohms): 10K; BOM_Supplier: LCSC; BOM_Supplier Part: C25804; BOM_JLCPCB Part Class: Basic Part; spicePre: R; spiceSymbolName: 0603WAF1002T5E
R33 = NCP18XH103F03RB: Manufacturer: muRata(村田); Add into BOM: yes; Resistance @ 25℃: 10kΩ; Resistance Tolerance: ±1%; B Constant (25℃/50℃): 3380K; Power: 100mW; Steady State Current (Max): 310uA; B Constant (25℃/85℃): 3334K; B Constant (25℃/100℃): 3455K; Name: NCP18XH103F03RB; Symbol: NCP18XH103F03RB; Device: NCP18XH103F03RB; LCSC Part Name: 10kΩ 电阻精度:±1% 3380K; Supplier Part: C13564; Manufacturer Part: NCP18XH103F03RB; Supplier Footprint: 0603; JLCPCB Part Class: Extended Part; Datasheet: https://atta.szlcsc.com/upload/public/pdf/source/20130819/1457706638081.pdf; Supplier: LCSC; Convert to PCB: yes; B Constant Tolerance: ±1%; B Constant (25℃/75℃): -; Operating Temperature: -40℃~+125℃
R35 = 10kΩ: as R9 on sheet PowerManagement; BOM_Supplier: LCSC; BOM_Supplier Part: C25804; BOM_JLCPCB Part Class: Basic Part; spicePre: R; spiceSymbolName: 0603WAF1002T5E
R39 = 1.6kΩ: BOM_Manufacturer: UniOhm; BOM_Manufacturer Part: 0603WAF1002T5E; nameAlias: Resistance; Resistance (Ohms): 10K; BOM_Supplier: LCSC; BOM_Supplier Part: C25804; BOM_JLCPCB Part Class: Basic Part; spicePre: R; spiceSymbolName: 0603WAF1002T5E
R40 = RreciseR_10k: BOM_Manufacturer: UniOhm; BOM_Manufacturer Part: 0603WAF1002T5E; nameAlias: Resistance; Resistance (Ohms): 10K; BOM_Supplier: LCSC; BOM_Supplier Part: C25804; BOM_JLCPCB Part Class: Basic Part; spicePre: R; spiceSymbolName: 0603WAF1002T5E
R41 = RreciseR_31.6k: BOM_Manufacturer: UniOhm; BOM_Manufacturer Part: 0603WAF1002T5E; nameAlias: Resistance; Resistance (Ohms): 10K; BOM_Supplier: LCSC; BOM_Supplier Part: C25804; BOM_JLCPCB Part Class: Basic Part; spicePre: R; spiceSymbolName: 0603WAF1002T5E
U7 U10 = COS722SR: Manufacturer: COSINE(科山芯创); Add into BOM: yes; Number of Circuits: 2; Voltage - Input Offset(Vos): 5mV; Gain Bandwidth Product(GBP): 10MHz; Slew Rate(SR): 7.5V/us; Supply Current: 650uA; Name: COS722SR; Symbol: COS722SR; Device: COS722SR; LCSC Part Name: COS722SR; Supplier Part: C693063; Manufacturer Part: COS722SR; Supplier Footprint: SOIC-8; JLCPCB Part Class: Extended Part; Datasheet: https://atta.szlcsc.com/upload/public/pdf/source/20200629/C693056_2991DE5392421DDCA1474C8C5608148D.pdf; Supplier: LCSC; Convert to PCB: yes
U8 = INA197AIDBVT: Manufacturer: TI(德州仪器); Add into BOM: yes; Name: INA197AIDBVT; Symbol: INA197AIDBVT; Device: INA197AIDBVT; LCSC Part Name: INA197AIDBVT; Supplier Part: C140332; Manufacturer Part: INA197AIDBVT; Supplier Footprint: SOT-23-5; JLCPCB Part Class: Extended Part; Datasheet: https://atta.szlcsc.com/upload/public/pdf/source/20171221/C140332_15138310678791195272.pdf; Supplier: LCSC; Convert to PCB: yes
U9 U11 = INA240A1DR: Manufacturer: TI(德州仪器); Add into BOM: yes; Name: INA240A1DR; Symbol: INA240A1DR; Device: INA240A1DR; LCSC Part Name: INA240A1DR; Supplier Part: C2060769; Manufacturer Part: INA240A1DR; Supplier Footprint: SOIC-8; JLCPCB Part Class: Extended Part; Datasheet: https://atta.szlcsc.com/upload/public/pdf/source/20210607/AED5CCB0280C8C5A414BD6EEEB43F6C3.pdf; Supplier: LCSC; Convert to PCB: yes
U12 = CJ431_C3113: Manufacturer: CJ(江苏长电/长晶); Name: CJ431; Add into BOM: yes; Output Type: 可调; Output Voltage: 2.5V~36V; Output Current: 100mA; Tolerance: ±0.5%; Temperature Coefficient: 50ppm/℃; Minimum Cathode Current for Regulation: 1mA; Symbol: CJ431_C3113; Device: CJ431_C3113; LCSC Part Name: 2.5V~36V 100mA; Supplier Part: C3113; Manufacturer Part: CJ431; Supplier Footprint: SOT-23; JLCPCB Part Class: Basic Part; Datasheet: https://atta.szlcsc.com/upload/public/pdf/source/20180115/C3113_15160149461261269385.pdf; Supplier: LCSC; Convert to PCB: yes; Operating Temperature: -25℃~+85℃@(TA)

## Sheet Controller.SchDoc
size OrCAD A; SheetNumber: 4; SheetTotal: 4
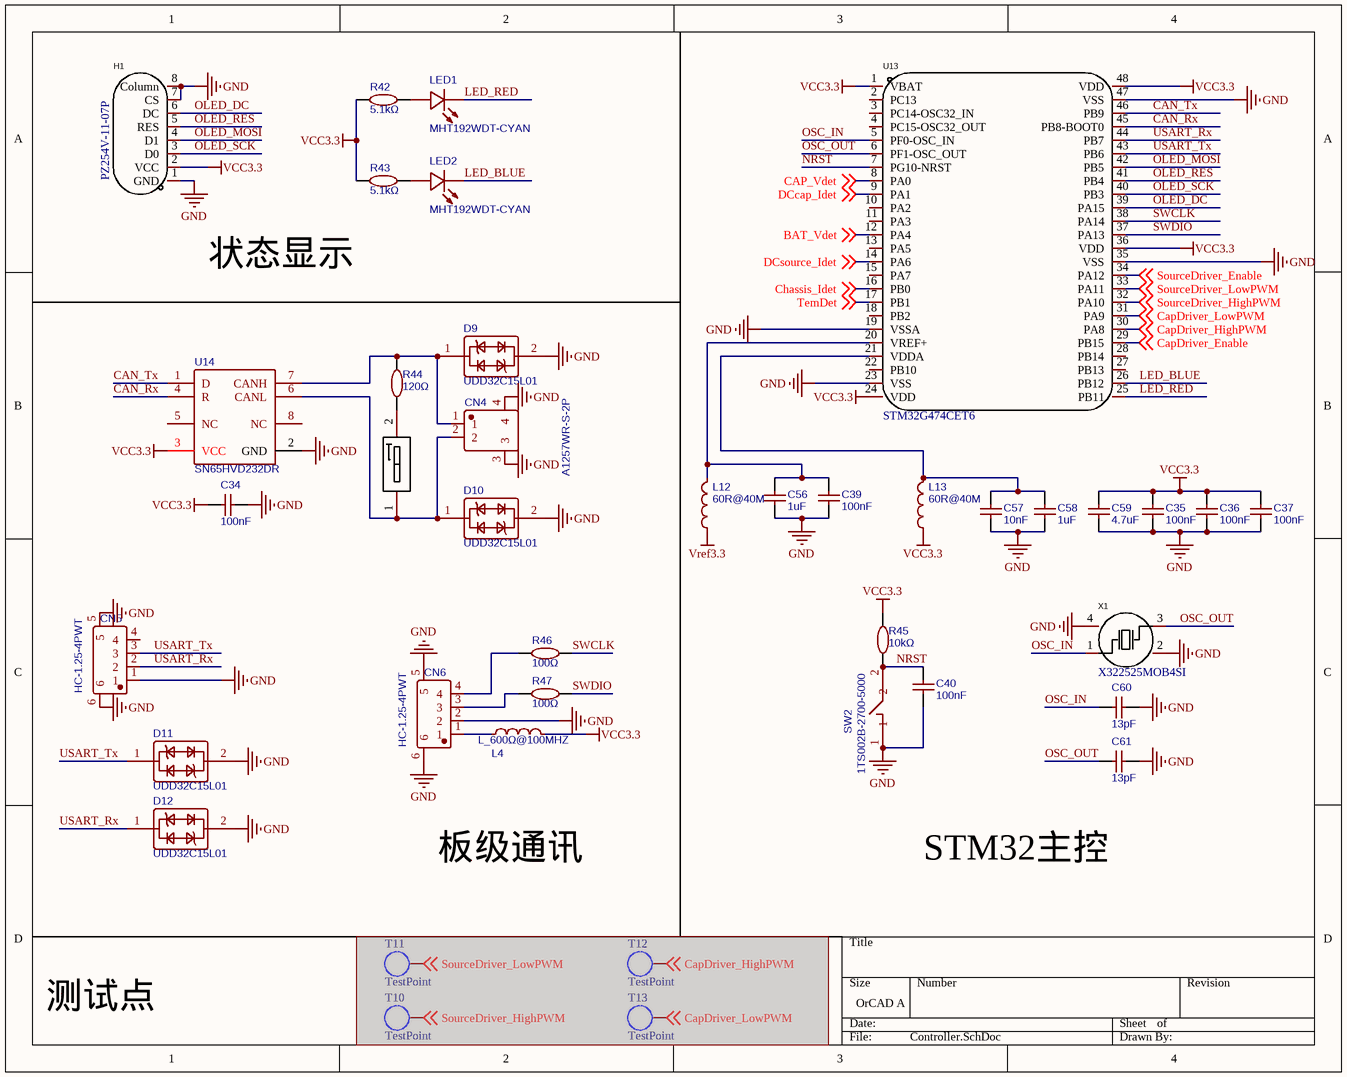
[diagram p3: Controller.SchDoc]

### Parts
C34  100nF  [C-RAD-0603]
C35  100nF  [C-RAD-0603]
C36  100nF  [C-RAD-0603]
C37  100nF  [C-RAD-0603]
C39  100nF  [C-RAD-0603]
C40  100nF  [C-RAD-0603]
C56  1uF  [C-RAD-0603]
C57  10nF  [C-RAD-0603]
C58  1uF  [C-RAD-0603]
C59  4.7uF  [C-RAD-0805]
C60  13pF  [C-RAD-0603]
C61  13pF  [C-RAD-0603]
CN4  A1257WR-S-2P  [CONN-SMD_A1257WR-S-2P]
CN5  HC-1.25-4PWT  [CONN-SMD_4P-P1.25-HC-1.25-4PWT]
CN6  HC-1.25-4PWT  [CONN-SMD_4P-P1.25-HC-1.25-4PWT]
D9  UDD32C15L01  [SOD-323_L1.8-W1.3-LS2.5-BI]
D10  UDD32C15L01  [SOD-323_L1.8-W1.3-LS2.5-BI]
D11  UDD32C15L01  [SOD-323_L1.8-W1.3-LS2.5-BI]
D12  UDD32C15L01  [SOD-323_L1.8-W1.3-LS2.5-BI]
H1  PZ254V-11-07P  [OLED_13inch]
L4  L_600Ω@100MHZ  [0805-1]
L12  60R@40M  [0603-1]
L13  60R@40M  [0603-1]
LED1  MHT192WDT-CYAN  [LED_0805]
LED2  MHT192WDT-CYAN  [LED_0805]
R42  5.1kΩ  [0603-1]
R43  5.1kΩ  [0603-1]
R44  120Ω  [0603-1]
R45  10kΩ  [0603-1]
R46  100Ω  [0603-1]
R47  100Ω  [0603-1]
SW1  DSHP01TSGET  [SW-SMD_DSHP01TSGET]  (value not drawn)
SW2  1TS002B-2700-5000  [SW_PB2_A1]
T10  TestPoint  [TestPoint]  (masked out: inside a compile mask, not in the netlist)
T11  TestPoint  [TestPoint]  (masked out: inside a compile mask, not in the netlist)
T12  TestPoint  [TestPoint]  (masked out: inside a compile mask, not in the netlist)
T13  TestPoint  [TestPoint]  (masked out: inside a compile mask, not in the netlist)
U13  STM32G474CET6  [LQFP-48_M]
U14  SN65HVD232DR  [SOIC127P610X175-8N]
X1  X322525MOB4SI  [OSC-3225]

### Nets
GND: C34.1 C35.1 C36.1 C37.1 C39.1 C40.1 C56.1 C57.1 C58.1 C59.1 C60.2 C61.2 CN4.3 CN4.4 CN5.1 CN5.5 CN5.6 CN6.2 CN6.5 CN6.6 D9.2 D10.2 D11.2 D12.2 H1.1(GND) H1.7(CS) H1.8(Column) SW2.1 U13.19(VSSA) U13.23(VSS) U13.35(VSS) U13.47(VSS) U14.2(GND) X1.2(GND) X1.4(GND)
VCC3.3: C34.2 C35.2 C36.2 C37.2 C59.2 H1.2(VCC) L4.2 L13.1 R42.2 R43.2 R45.2 U13.1(VBAT) U13.24(VDD) U13.36(VDD) U13.48(VDD) U14.3(VCC)
Vref3.3: L12.1
BAT_Vdet: U13.12(PA4) ; off-sheet BAT_Vdet
CAN_Rx: U13.45(PB8-BOOT0) U14.4(R)
CAN_Tx: U13.46(PB9) U14.1(D)
CAP_Vdet: U13.8(PA0) ; off-sheet CAP_Vdet
CapDriver_Enable: U13.29(PB15) ; off-sheet CapDriver_Enable
CapDriver_HighPWM: U13.30(PA8) ; off-sheet CapDriver_HighPWM
CapDriver_LowPWM: U13.31(PA9) ; off-sheet CapDriver_LowPWM
Chassis_Idet: U13.16(PB0) ; off-sheet Chassis_Idet
DCcap_Idet: U13.9(PA1) ; off-sheet DCcap_Idet
DCsource_Idet: U13.14(PA6) ; off-sheet DCsource_Idet
LED_BLUE: LED2.2(K) U13.26(PB12)
LED_RED: LED1.2(K) U13.25(PB11)
NRST: C40.2 R45.1 SW2.2 U13.7(PG10-NRST)
OLED_DC: H1.6(DC) U13.39(PA15)
OLED_MOSI: H1.4(D1) U13.42(PB5)
OLED_RES: H1.5(RES) U13.41(PB4)
OLED_SCK: H1.3(D0) U13.40(PB3)
OSC_IN: C60.1 U13.5(PF0-OSC_IN) X1.1(OSC1)
OSC_OUT: C61.1 U13.6(PF1-OSC_OUT) X1.3(OSC2)
SourceDriver_Enable: U13.34(PA12) ; off-sheet SourceDriver_Enable
SourceDriver_HighPWM: U13.32(PA10) ; off-sheet SourceDriver_HighPWM
SourceDriver_LowPWM: U13.33(PA11) ; off-sheet SourceDriver_LowPWM
SWCLK: R46.2 U13.38(PA14)
SWDIO: R47.2 U13.37(PA13)
TemDet: U13.17(PB1) ; off-sheet TemDet
USART_Rx: CN5.2 D12.1 U13.44(PB7)
USART_Tx: CN5.3 D11.1 U13.43(PB6)
NetC39_2: C39.2 C56.2 L12.2 U13.20(VREF+)
NetC57_2: C57.2 C58.2 L13.2 U13.21(VDDA)
NetCN4_1: CN4.1 D9.1 R44.2 U14.7(CANH)
NetCN4_2: CN4.2 D10.1 SW1.1(A1) U14.6(CANL)
NetCN6_1: CN6.1 L4.1
NetCN6_3: CN6.3 R47.1
NetCN6_4: CN6.4 R46.1
NetLED1_1: LED1.1(A) R42.1
NetLED2_1: LED2.1(A) R43.1
NetR44_1: R44.1 SW1.2(B1)

Not connected (* = marked no-connect by the designer): CN5 4; U13 2(PC13) 3(PC14-OSC32_IN) 4(PC15-OSC32_OUT) 10(PA2) 11(PA3) 13(PA5) 15(PA7) 18(PB2) 22(PB10) 27(PB13) 28(PB14); U14 5(NC) 8(NC)

### Notes on the sheet
- 状态显示
- 板级通讯
- STM32主控
- 测试点

### Library data of the parts
C34-C37 C39 C40 = 100nF: as C8 on sheet 4Switch_DCDC; BOM_Supplier: LCSC; BOM_Supplier Part: C157687; BOM_JLCPCB Part Class: Extended Part; spicePre: C; spiceSymbolName: 0805CG330J500NT
C56 C58 = 1uF: as C20 on sheet PowerManagement; BOM_Supplier: LCSC; BOM_Supplier Part: C157687; BOM_JLCPCB Part Class: Extended Part; spicePre: C; spiceSymbolName: 0805CG330J500NT
C57 = 10nF: as C49 on sheet Signal; BOM_Supplier: LCSC; BOM_Supplier Part: C157687; BOM_JLCPCB Part Class: Extended Part; spicePre: C; spiceSymbolName: 0805CG330J500NT
C59 = 4.7uF: BOM_Manufacturer: Guangdong Fenghua Advanced Tech; BOM_Manufacturer Part: 0805CG330J500NT; nameAlias: Capacitance; Contributor: LCSC; BOM_Supplier: LCSC; BOM_Supplier Part: C157687; BOM_JLCPCB Part Class: Extended Part; spicePre: C; spiceSymbolName: 0805CG330J500NT
C60 C61 = 13pF: BOM_Manufacturer: Guangdong Fenghua Advanced Tech; BOM_Manufacturer Part: 0805CG330J500NT; nameAlias: Capacitance; Contributor: LCSC; BOM_Supplier: LCSC; BOM_Supplier Part: C157687; BOM_JLCPCB Part Class: Extended Part; spicePre: C; spiceSymbolName: 0805CG330J500NT
CN4 = A1257WR-S-2P: BOM_Manufacturer: Changjiang Connectors; Contributor: LCSC; BOM_Supplier: LCSC; BOM_Supplier Part: C225125; BOM_Manufacturer Part: A1257WR-S-2P; BOM_JLCPCB Part Class: Extended Part; spicePre: C; spiceSymbolName: A1257WR-S-2P
CN5 CN6 = HC-1.25-4PWT: BOM_Manufacturer: HCTL(华灿天禄); Contributor: LCSC; BOM_Supplier: LCSC; BOM_Supplier Part: C2845381; BOM_Manufacturer Part: HC-1.25-4PWT; BOM_JLCPCB Part Class: Extended Part; spicePre: C; spiceSymbolName: HC-1.25-4PWT
D9-D12 = UDD32C15L01: BOM_Manufacturer: Brightking Elec (TAIWAN); Contributor: LCSC; BOM_Supplier: LCSC; BOM_Supplier Part: C313321; BOM_Manufacturer Part: UDD32C15L01; BOM_JLCPCB Part Class: Extended Part; spicePre: D; spiceSymbolName: UDD32C15L01
H1 = OLED_1.3inch: Manufacturer: XFCN(兴飞); Add into BOM: yes; Pitch: 2.54mm; Pin Structure: 1x7P; Circluar Pins/Square Pins: 方针; Name: PZ254V-11-07P; Symbol: PZ254V-11-07P; Device: PZ254V-11-07P; LCSC Part Name: 2.54mm 1x7P 直插 方针; Supplier Part: C492406; Manufacturer Part: PZ254V-11-07P; Supplier Footprint: 直插,P=2.54mm; JLCPCB Part Class: Extended Part; Datasheet: https://atta.szlcsc.com/upload/public/pdf/source/20200309/C492406_654C533EE691117E22DD9F76C114C2D9.pdf; Supplier: LCSC; Convert to PCB: yes; Number of Pins: 7; Number of Rows: 1; Row Spacing: -; Mounting Type: 直插; Current Rating (Max): -; Voltage Rating (Max): -; Length of Mating Pin: 6mm; Insulation Height: 2.5mm; Length of End Connection Pin: 3mm; Contact Material: 黄铜; Contact Plating: -; Operating Temperature Range: -40℃~+105℃; Color: 黑色
L4 = L_600Ω@100MHZ: BOM_Manufacturer: FH; BOM_Manufacturer Part: CBW201209U601T; nameAlias: Value; BOM_Supplier: LCSC; BOM_Supplier Part: C21286; BOM_JLCPCB Part Class: Extended Part; spicePre: L; spiceSymbolName: CBW201209U601T
L12 L13 = 60R@40M: as L5 on sheet Signal; BOM_Supplier: LCSC; BOM_Supplier Part: C21286; BOM_JLCPCB Part Class: Extended Part; spicePre: L; spiceSymbolName: CBW201209U601T
LED1 LED2 = MHT192WDT-CYAN: as LED3 on sheet PowerManagement; BOM_Supplier: LCSC; BOM_Supplier Part: C496821; BOM_Manufacturer Part: MHT192WDT-CYAN; BOM_JLCPCB Part Class: Extended Part; spicePre: L; spiceSymbolName: MHT192WDT-CYAN
R42 R43 = 5.1kΩ: BOM_Manufacturer: UniOhm; BOM_Manufacturer Part: 0603WAF1002T5E; nameAlias: Resistance; Resistance (Ohms): 10K; BOM_Supplier: LCSC; BOM_Supplier Part: C25804; BOM_JLCPCB Part Class: Basic Part; spicePre: R; spiceSymbolName: 0603WAF1002T5E
R44 = 120Ω: BOM_Manufacturer: UniOhm; BOM_Manufacturer Part: 0603WAF1002T5E; nameAlias: Resistance; Resistance (Ohms): 10K; BOM_Supplier: LCSC; BOM_Supplier Part: C25804; BOM_JLCPCB Part Class: Basic Part; spicePre: R; spiceSymbolName: 0603WAF1002T5E
R45 = 10kΩ: as R9 on sheet PowerManagement; BOM_Supplier: LCSC; BOM_Supplier Part: C25804; BOM_JLCPCB Part Class: Basic Part; spicePre: R; spiceSymbolName: 0603WAF1002T5E
R46 R47 = 100Ω: as R56 on sheet PowerManagement; BOM_Supplier: LCSC; BOM_Supplier Part: C25804; BOM_JLCPCB Part Class: Basic Part; spicePre: R; spiceSymbolName: 0603WAF1002T5E
SW1 = DSHP01TSGET: Manufacturer: YE; Add into BOM: yes; Circuit: 单刀单掷; Number of Positions: 1; Name: DSHP01TSGET; Symbol: DSHP01TSGET; Device: DSHP01TSGET; LCSC Part Name: 1.27mm 1位低推贴胶; Supplier Part: C126848; Manufacturer Part: DSHP01TSGET; Supplier Footprint: SMD,5.4x2.85mm; JLCPCB Part Class: Extended Part; Datasheet: https://atta.szlcsc.com/upload/public/pdf/source/20220428/74B573882803886B9DF6FBBC1614692A.pdf; Supplier: LCSC; Convert to PCB: yes; Type: 平拨，凹槽式; Lead Pitch: 1.27mm; Color: 黑色
SW2 = 1TS002B-2700-5000: BOM_Manufacturer: HYP; Contributor: LCSC; BOM_Supplier: LCSC; BOM_Supplier Part: C318844; BOM_Manufacturer Part: 1TS002B-2700-5000; BOM_JLCPCB Part Class: Extended Part; spicePre: S; spiceSymbolName: 1TS002B-2700-5000
U13 = STM32G474CET6: Manufacturer: ST(意法半导体); Add into BOM: yes; CPU Core: ARM Cortex-M4; CPU Maximum Speed: 170MHz; Operating Voltage Range: 1.71V~3.6V; Program Storage Size: 512KB; Program Memory Type: FLASH; RAM Size: 128KB; GPIO Ports Number: 38; ADC (Bit): 12bit; Peripheral/Function: PWM；看门狗；PWM; Internal Oscillator: 有; Name: STM32G474CET6; Symbol: STM32G474CET6; Device: STM32G474CET6; LCSC Part Name: ARM Cortex-M4 170MHz; Supplier Part: C730125; Manufacturer Part: STM32G474CET6; Supplier Footprint: LQFP-48(7x7); JLCPCB Part Class: Extended Part; Datasheet: https://atta.szlcsc.com/upload/public/pdf/source/20200902/C431632_38212262685EE30B1989689374F08940.pdf; Supplier: LCSC; Convert to PCB: yes; EEPROM: 512KB; DAC (Bit): 12bit; PWM (Bit): -; Universal Serial Bus: -; Internal Comparator: -; communication protocol: -; Watchdog: -; Real-Time Clock: -; Infrared Data Association: -; Low-Voltage Detect: -; CCP Capture/Compare: -; Secure Digital Input and Output: -; Direct Memory Access: -; Operating Temperature Range: -40℃~+85℃
U14 = SN65HVD232DR: BOM_Manufacturer: TI; BOM_Supplier: LCSC; BOM_Manufacturer Part: SN65HVD232DR; BOM_Supplier Part: C30530; BOM_JLCPCB Part Class: Extended Part; spicePre: U; spiceSymbolName: SN65HVD232DR
X1 = X322525MOB4SI: Manufacturer: YXC(扬兴晶振); Name: 25MHz; Add into BOM: yes; Crystal Type: 贴片无源晶振; Value: 25MHz; Frequency Tolerance: ±10ppm; Frequency Stability: ±30ppm; Load Capacitance: 12pF; Symbol: X322525MOB4SI; Device: X322525MOB4SI; LCSC Part Name: 25MHz ±10ppm 12pF; Supplier Part: C9006; Manufacturer Part: X322525MOB4SI; Supplier Footprint: SMD3225-4P; JLCPCB Part Class: Basic Part; Datasheet: https://atta.szlcsc.com/upload/public/pdf/source/20210329/C112971_1F611BDC486E193C1706F6D8EB5AA189.pdf; Supplier: LCSC; Convert to PCB: yes; Operating Temperature: -40℃~+85℃

## Nets that join several sheets
GND: 4Switch_DCDC (24 pins), PowerManagement (37 pins), Signal (32 pins), Controller (35 pins)
VCC3.3: 4Switch_DCDC (6 pins), PowerManagement (C21.1 U5.5), Signal (9 pins), Controller (16 pins)
VCC5: PowerManagement (6 pins), Signal (C31.2 R39.2)
VCC12_boot: 4Switch_DCDC (6 pins), PowerManagement (R52.2)
VCC24: PowerManagement (7 pins), Signal (5 pins)
VCC24_H: PowerManagement (5 pins), Signal (R29.2 R30.2)
VCC_cap: PowerManagement (CN3.2), Signal (R32.2 R36.1 R60.2)
VCC_DCcap: 4Switch_DCDC (8 pins), Signal (R36.2 R61.2)
VCC_DCsource: 4Switch_DCDC (8 pins), Signal (R22.1 R58.2)
Vref3.3: Signal (6 pins), Controller (L12.1)
BAT_Vdet: Signal (U7.1 U7.2), Controller (U13.12)
CAP_Vdet: Signal (U10.1 U10.2), Controller (U13.8)
CapDriver_Enable: 4Switch_DCDC (U2.5), Controller (U13.29)
CapDriver_HighPWM: 4Switch_DCDC (U2.2), Controller (U13.30)
CapDriver_LowPWM: 4Switch_DCDC (U2.3), Controller (U13.31)
Chassis_Idet: Signal (U8.1), Controller (U13.16)
DCcap_Idet: Signal (U11.5), Controller (U13.9)
DCsource_Idet: Signal (U9.5), Controller (U13.14)
SourceDriver_Enable: 4Switch_DCDC (U1.5), Controller (U13.34)
SourceDriver_HighPWM: 4Switch_DCDC (U1.3), Controller (U13.32)
SourceDriver_LowPWM: 4Switch_DCDC (U1.2), Controller (U13.33)
TemDet: Signal (U10.6 U10.7), Controller (U13.17)